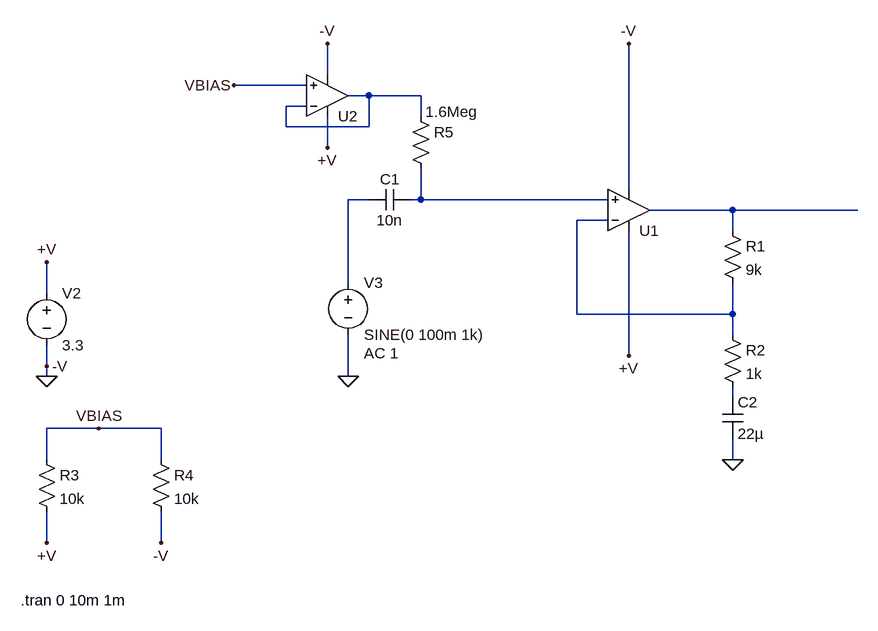
[diagram p0: schematic AFE_gain_test.asc]
AFE_gain_test.asc, the LTspice schematic file:
Version 4.1
SHEET 1 1756 1092
WIRE -272 -48 -272 -96
WIRE -304 -32 -416 -32
WIRE -208 -16 -240 -16
WIRE -128 -16 -208 -16
WIRE -304 0 -336 0
WIRE -128 16 -128 -16
WIRE -336 32 -336 0
WIRE -208 32 -208 -16
WIRE -208 32 -336 32
WIRE -272 64 -272 16
WIRE 192 128 192 -96
WIRE -208 144 -240 144
WIRE -128 144 -128 96
WIRE -128 144 -144 144
WIRE 160 144 -128 144
WIRE 352 160 224 160
WIRE 544 160 352 160
WIRE 160 176 112 176
WIRE 352 192 352 160
WIRE -240 272 -240 144
WIRE -704 288 -704 240
WIRE 112 320 112 176
WIRE 352 320 352 272
WIRE 352 320 112 320
WIRE 352 352 352 320
WIRE 192 384 192 192
WIRE -704 400 -704 368
WIRE -704 416 -704 400
WIRE -240 416 -240 352
WIRE 352 448 352 432
WIRE -624 496 -704 496
WIRE -528 496 -624 496
WIRE -704 544 -704 496
WIRE -528 544 -528 496
WIRE 352 544 352 512
WIRE -704 672 -704 624
WIRE -528 672 -528 624
FLAG -704 416 0
FLAG -704 400 -V
FLAG -704 240 +V
FLAG 192 -96 -V
FLAG 192 384 +V
FLAG 352 544 0
FLAG -528 672 -V
FLAG -624 496 VBIAS
FLAG -272 -96 -V
FLAG -272 64 +V
FLAG -416 -32 VBIAS
FLAG -704 672 +V
FLAG -240 416 0
SYMBOL voltage -704 272 R0
SYMATTR InstName V2
SYMATTR Value 3.3
SYMBOL res 336 176 R0
SYMATTR InstName R1
SYMATTR Value 9k
SYMBOL res 336 336 R0
SYMATTR InstName R2
SYMATTR Value 1k
SYMBOL cap 336 448 R0
SYMATTR InstName C2
SYMATTR Value 22µ
SYMBOL OpAmps\\UniversalOpAmp2 192 160 M180
SYMATTR InstName U1
SYMATTR Value2 Avol=713k GBW=10Meg Slew=7Meg
SYMBOL cap -144 128 R90
WINDOW 0 0 32 VBottom 2
WINDOW 3 32 32 VTop 2
SYMATTR InstName C1
SYMATTR Value 10n
SYMBOL res -720 528 R0
SYMATTR InstName R3
SYMATTR Value 10k
SYMBOL res -544 528 R0
SYMATTR InstName R4
SYMATTR Value 10k
SYMBOL OpAmps\\UniversalOpAmp2 -272 -16 M180
SYMATTR InstName U2
SYMATTR Value2 Avol=713k GBW=10Meg Slew=7Meg
SYMBOL res -144 0 R0
WINDOW 3 23 9 Left 2
SYMATTR Value 1.6Meg
SYMATTR InstName R5
SYMBOL voltage -240 256 R0
WINDOW 123 24 124 Left 2
WINDOW 39 0 0 Left 0
SYMATTR Value2 AC 1
SYMATTR InstName V3
SYMATTR Value SINE(0 100m 1k)
TEXT -744 760 Left 2 !.tran 0 10m 1m

The netlist it stands for:
* AFE_gain_test.asc
V2 +V 0 3.3
R1 N004 N005 9k
R2 N005 N006 1k
C2 N006 0 22µ
X§U1 N003 N005 +V 0 N004 level2 Avol=713k GBW=10Meg Slew=7Meg Ilimit=25m Rail=0 Vos=0 En=0 Enk=0 In=0 Ink=0 Rin=500Meg  ; pins In+ In- V+ V- OUT
C1 N003 N002 10n
R3 VBIAS +V 10k
R4 VBIAS 0 10k
X§U2 VBIAS N001 +V 0 N001 level2 Avol=713k GBW=10Meg Slew=7Meg Ilimit=25m Rail=0 Vos=0 En=0 Enk=0 In=0 Ink=0 Rin=500Meg  ; pins In+ In- V+ V- OUT
R5 N001 N003 1.6Meg
V3 N002 0 SINE(0 100m 1k) AC 1
.tran 0 10m 1m
.lib UniversalOpAmp2.lib
.backanno
.end